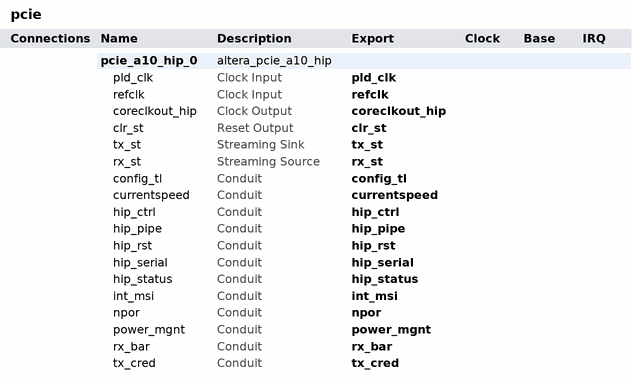
[diagram p0: system contents]
# Platform Designer (Qsys) system pcie, Arria 10 10AX115N2F45I1SG
# Parameters at their usual value, and those the tool derives, are not listed.
package require -exact qsys 18.0
create_system pcie
set_project_property DEVICE_FAMILY {Arria 10}
set_project_property DEVICE 10AX115N2F45I1SG

add_instance pcie_a10_hip_0 altera_pcie_a10_hip 18.0
set_instance_property pcie_a10_hip_0 AUTO_EXPORT true
set_instance_parameter_value pcie_a10_hip_0 adme_enable_hwtcl 0
set_instance_parameter_value pcie_a10_hip_0 advance_error_reporting_hwtcl 0
set_instance_parameter_value pcie_a10_hip_0 apps_type_hwtcl 0
set_instance_parameter_value pcie_a10_hip_0 ari_support_hwtcl 0
set_instance_parameter_value pcie_a10_hip_0 ast_trs_num_desc_hwtcl 16
set_instance_parameter_value pcie_a10_hip_0 ast_trs_rxdata_width_hwtcl 256
set_instance_parameter_value pcie_a10_hip_0 ast_trs_rxdesc_width_hwtcl 256
set_instance_parameter_value pcie_a10_hip_0 ast_trs_rxmty_width_hwtcl 32
set_instance_parameter_value pcie_a10_hip_0 ast_trs_txdata_width_hwtcl 256
set_instance_parameter_value pcie_a10_hip_0 ast_trs_txdesc_width_hwtcl 256
set_instance_parameter_value pcie_a10_hip_0 ast_trs_txmty_width_hwtcl 32
set_instance_parameter_value pcie_a10_hip_0 ast_trs_txstatus_width_hwtcl 256
set_instance_parameter_value pcie_a10_hip_0 avmm_addr_width_hwtcl 64
set_instance_parameter_value pcie_a10_hip_0 bar0_address_width_hwtcl 12
set_instance_parameter_value pcie_a10_hip_0 bar0_type_hwtcl {32-bit non-prefetchable memory}
set_instance_parameter_value pcie_a10_hip_0 bar1_address_width_hwtcl 12
set_instance_parameter_value pcie_a10_hip_0 bar1_type_hwtcl {32-bit non-prefetchable memory}
set_instance_parameter_value pcie_a10_hip_0 bar2_address_width_hwtcl 18
set_instance_parameter_value pcie_a10_hip_0 bar3_address_width_hwtcl 18
set_instance_parameter_value pcie_a10_hip_0 bar3_type_hwtcl {32-bit non-prefetchable memory}
set_instance_parameter_value pcie_a10_hip_0 base_device NIGHTFURY5
set_instance_parameter_value pcie_a10_hip_0 bfm_drive_interface_clk_hwtcl 1
set_instance_parameter_value pcie_a10_hip_0 bfm_drive_interface_control_hwtcl 1
set_instance_parameter_value pcie_a10_hip_0 bfm_drive_interface_npor_hwtcl 1
set_instance_parameter_value pcie_a10_hip_0 bfm_drive_interface_pipe_hwtcl 1
set_instance_parameter_value pcie_a10_hip_0 cg_a2p_addr_map_pass_thru_bits_hwtcl 12
set_instance_parameter_value pcie_a10_hip_0 cg_enable_a2p_interrupt_hwtcl 0
set_instance_parameter_value pcie_a10_hip_0 cg_enable_advanced_interrupt_hwtcl 0
set_instance_parameter_value pcie_a10_hip_0 class_code_hwtcl 16711680
set_instance_parameter_value pcie_a10_hip_0 completion_timeout_hwtcl NONE
set_instance_parameter_value pcie_a10_hip_0 cseb_autonomous_hwtcl 0
set_instance_parameter_value pcie_a10_hip_0 cseb_config_bypass_gui_hwtcl 0
set_instance_parameter_value pcie_a10_hip_0 design_environment_hwtcl QSYS
set_instance_parameter_value pcie_a10_hip_0 devhide_support_hwtcl 0
set_instance_parameter_value pcie_a10_hip_0 device_embedded_ep_support_hwtcl 0
set_instance_parameter_value pcie_a10_hip_0 device_id_hwtcl 4
set_instance_parameter_value pcie_a10_hip_0 dis_adapt 0
set_instance_parameter_value pcie_a10_hip_0 dma_use_scfifo_ext_hwtcl 0
set_instance_parameter_value pcie_a10_hip_0 ecrc_check_capable_hwtcl 0
set_instance_parameter_value pcie_a10_hip_0 ecrc_gen_capable_hwtcl 0
set_instance_parameter_value pcie_a10_hip_0 enable_alternate_link_list_hwtcl 0
set_instance_parameter_value pcie_a10_hip_0 enable_ast_trs_hwtcl 0
set_instance_parameter_value pcie_a10_hip_0 enable_avst_reset_hwtcl 1
set_instance_parameter_value pcie_a10_hip_0 enable_custom_features_hwtcl 0
set_instance_parameter_value pcie_a10_hip_0 enable_devkit_conduit_hwtcl 0
set_instance_parameter_value pcie_a10_hip_0 enable_example_design_qii_hwtcl 1
set_instance_parameter_value pcie_a10_hip_0 enable_example_design_sim_hwtcl 1
set_instance_parameter_value pcie_a10_hip_0 enable_example_design_synth_hwtcl 1
set_instance_parameter_value pcie_a10_hip_0 enable_example_design_tb_hwtcl 1
set_instance_parameter_value pcie_a10_hip_0 enable_g3_bypass_equlz_rp_sim_hwtcl 0
set_instance_parameter_value pcie_a10_hip_0 enable_gen3phase2eq_timechange 0
set_instance_parameter_value pcie_a10_hip_0 enable_hip_status_for_avmm_hwtcl 0
set_instance_parameter_value pcie_a10_hip_0 enable_lmi_hwtcl 0
set_instance_parameter_value pcie_a10_hip_0 enable_nobar_slection_hwtcl 0
set_instance_parameter_value pcie_a10_hip_0 enable_rxm_burst_hwtcl 0
set_instance_parameter_value pcie_a10_hip_0 enable_skp_det 0
set_instance_parameter_value pcie_a10_hip_0 enable_soft_dfe 0
set_instance_parameter_value pcie_a10_hip_0 export_fpll_output_to_top_level_hwtcl 0
set_instance_parameter_value pcie_a10_hip_0 export_phy_input_to_top_level_hwtcl 0
set_instance_parameter_value pcie_a10_hip_0 extended_tag_support_hwtcl 0
set_instance_parameter_value pcie_a10_hip_0 flr_capability_user_hwtcl 0
set_instance_parameter_value pcie_a10_hip_0 force_tag_checking_on_hwtcl 0
set_instance_parameter_value pcie_a10_hip_0 gen3_coeff_1_hwtcl 8
set_instance_parameter_value pcie_a10_hip_0 gen3_coeff_3_ber_meas_hwtcl 12ms
set_instance_parameter_value pcie_a10_hip_0 include_virtio_capabilities_hwtcl 0
set_instance_parameter_value pcie_a10_hip_0 interface_type_hwtcl Avalon-ST
set_instance_parameter_value pcie_a10_hip_0 internal_controller_hwtcl 1
set_instance_parameter_value pcie_a10_hip_0 link2csr_width_hwtcl 16
set_instance_parameter_value pcie_a10_hip_0 maximum_payload_size_hwtcl 2048
set_instance_parameter_value pcie_a10_hip_0 part_trait_device 10AX115R4F40I3SG
set_instance_parameter_value pcie_a10_hip_0 pf0_ats_invalidate_queue_depth_hwtcl 0
set_instance_parameter_value pcie_a10_hip_0 pf0_bar0_prefetchable_hwtcl 1
set_instance_parameter_value pcie_a10_hip_0 pf0_bar0_present_hwtcl 1
set_instance_parameter_value pcie_a10_hip_0 pf0_bar0_size_hwtcl 12
set_instance_parameter_value pcie_a10_hip_0 pf0_bar0_type_hwtcl 1
set_instance_parameter_value pcie_a10_hip_0 pf0_bar1_prefetchable_hwtcl 1
set_instance_parameter_value pcie_a10_hip_0 pf0_bar1_present_hwtcl 0
set_instance_parameter_value pcie_a10_hip_0 pf0_bar1_size_hwtcl 12
set_instance_parameter_value pcie_a10_hip_0 pf0_bar2_prefetchable_hwtcl 1
set_instance_parameter_value pcie_a10_hip_0 pf0_bar2_present_hwtcl 0
set_instance_parameter_value pcie_a10_hip_0 pf0_bar2_size_hwtcl 12
set_instance_parameter_value pcie_a10_hip_0 pf0_bar2_type_hwtcl 1
set_instance_parameter_value pcie_a10_hip_0 pf0_bar3_prefetchable_hwtcl 1
set_instance_parameter_value pcie_a10_hip_0 pf0_bar3_present_hwtcl 0
set_instance_parameter_value pcie_a10_hip_0 pf0_bar3_size_hwtcl 12
set_instance_parameter_value pcie_a10_hip_0 pf0_bar4_prefetchable_hwtcl 1
set_instance_parameter_value pcie_a10_hip_0 pf0_bar4_present_hwtcl 0
set_instance_parameter_value pcie_a10_hip_0 pf0_bar4_size_hwtcl 12
set_instance_parameter_value pcie_a10_hip_0 pf0_bar4_type_hwtcl 1
set_instance_parameter_value pcie_a10_hip_0 pf0_bar5_prefetchable_hwtcl 1
set_instance_parameter_value pcie_a10_hip_0 pf0_bar5_present_hwtcl 0
set_instance_parameter_value pcie_a10_hip_0 pf0_bar5_size_hwtcl 12
set_instance_parameter_value pcie_a10_hip_0 pf0_exprom_bar_present_hwtcl 0
set_instance_parameter_value pcie_a10_hip_0 pf0_exprom_bar_size_hwtcl 12
set_instance_parameter_value pcie_a10_hip_0 pf0_extra_bar_present_hwtcl 0
set_instance_parameter_value pcie_a10_hip_0 pf0_extra_bar_size_hwtcl 12
set_instance_parameter_value pcie_a10_hip_0 pf0_interrupt_pin_hwtcl inta
set_instance_parameter_value pcie_a10_hip_0 pf0_intr_line_hwtcl 0
set_instance_parameter_value pcie_a10_hip_0 pf0_msi_multi_message_capable_hwtcl 4
set_instance_parameter_value pcie_a10_hip_0 pf0_msix_pba_bir_hwtcl 0
set_instance_parameter_value pcie_a10_hip_0 pf0_msix_pba_offset_hwtcl 0
set_instance_parameter_value pcie_a10_hip_0 pf0_msix_table_bir_hwtcl 0
set_instance_parameter_value pcie_a10_hip_0 pf0_msix_table_offset_hwtcl 0
set_instance_parameter_value pcie_a10_hip_0 pf0_msix_table_size_hwtcl 0
set_instance_parameter_value pcie_a10_hip_0 pf0_pci_prog_intfc_byte_hwtcl 0
set_instance_parameter_value pcie_a10_hip_0 pf0_subclass_code_hwtcl 0
set_instance_parameter_value pcie_a10_hip_0 pf0_tph_dev_specific_mode_support_hwtcl 0
set_instance_parameter_value pcie_a10_hip_0 pf0_tph_int_mode_support_hwtcl 0
set_instance_parameter_value pcie_a10_hip_0 pf0_tph_st_table_location_hwtcl 0
set_instance_parameter_value pcie_a10_hip_0 pf0_tph_st_table_size_hwtcl 63
set_instance_parameter_value pcie_a10_hip_0 pf0_vf_bar0_prefetchable_hwtcl 1
set_instance_parameter_value pcie_a10_hip_0 pf0_vf_bar0_present_hwtcl 0
set_instance_parameter_value pcie_a10_hip_0 pf0_vf_bar0_size_hwtcl 12
set_instance_parameter_value pcie_a10_hip_0 pf0_vf_bar0_type_hwtcl 1
set_instance_parameter_value pcie_a10_hip_0 pf0_vf_bar1_prefetchable_hwtcl 1
set_instance_parameter_value pcie_a10_hip_0 pf0_vf_bar1_present_hwtcl 0
set_instance_parameter_value pcie_a10_hip_0 pf0_vf_bar1_size_hwtcl 12
set_instance_parameter_value pcie_a10_hip_0 pf0_vf_bar2_prefetchable_hwtcl 1
set_instance_parameter_value pcie_a10_hip_0 pf0_vf_bar2_present_hwtcl 0
set_instance_parameter_value pcie_a10_hip_0 pf0_vf_bar2_size_hwtcl 12
set_instance_parameter_value pcie_a10_hip_0 pf0_vf_bar2_type_hwtcl 1
set_instance_parameter_value pcie_a10_hip_0 pf0_vf_bar3_prefetchable_hwtcl 1
set_instance_parameter_value pcie_a10_hip_0 pf0_vf_bar3_present_hwtcl 0
set_instance_parameter_value pcie_a10_hip_0 pf0_vf_bar3_size_hwtcl 12
set_instance_parameter_value pcie_a10_hip_0 pf0_vf_bar4_prefetchable_hwtcl 1
set_instance_parameter_value pcie_a10_hip_0 pf0_vf_bar4_present_hwtcl 0
set_instance_parameter_value pcie_a10_hip_0 pf0_vf_bar4_size_hwtcl 12
set_instance_parameter_value pcie_a10_hip_0 pf0_vf_bar4_type_hwtcl 1
set_instance_parameter_value pcie_a10_hip_0 pf0_vf_bar5_prefetchable_hwtcl 1
set_instance_parameter_value pcie_a10_hip_0 pf0_vf_bar5_present_hwtcl 0
set_instance_parameter_value pcie_a10_hip_0 pf0_vf_bar5_size_hwtcl 12
set_instance_parameter_value pcie_a10_hip_0 pf0_vf_count_user_hwtcl 0
set_instance_parameter_value pcie_a10_hip_0 pf0_vf_device_id_hwtcl 0
set_instance_parameter_value pcie_a10_hip_0 pf0_vf_msix_pba_bir_hwtcl 0
set_instance_parameter_value pcie_a10_hip_0 pf0_vf_msix_pba_offset_hwtcl 0
set_instance_parameter_value pcie_a10_hip_0 pf0_vf_msix_tbl_bir_hwtcl 0
set_instance_parameter_value pcie_a10_hip_0 pf0_vf_msix_tbl_offset_hwtcl 0
set_instance_parameter_value pcie_a10_hip_0 pf0_vf_msix_tbl_size_hwtcl 0
set_instance_parameter_value pcie_a10_hip_0 pf0_vf_tph_dev_specific_mode_support_hwtcl 0
set_instance_parameter_value pcie_a10_hip_0 pf0_vf_tph_int_mode_support_hwtcl 0
set_instance_parameter_value pcie_a10_hip_0 pf0_vf_tph_st_table_location_hwtcl 0
set_instance_parameter_value pcie_a10_hip_0 pf0_vf_tph_st_table_size_hwtcl 63
set_instance_parameter_value pcie_a10_hip_0 pf0_virtio_capability_present_hwtcl 0
set_instance_parameter_value pcie_a10_hip_0 pf0_virtio_cmn_config_bar_indicator_hwtcl 0
set_instance_parameter_value pcie_a10_hip_0 pf0_virtio_cmn_config_bar_offset_hwtcl 0
set_instance_parameter_value pcie_a10_hip_0 pf0_virtio_cmn_config_structure_length_hwtcl 0
set_instance_parameter_value pcie_a10_hip_0 pf0_virtio_device_specific_cap_present_hwtcl 0
set_instance_parameter_value pcie_a10_hip_0 pf0_virtio_devspecific_bar_indicator_hwtcl 0
set_instance_parameter_value pcie_a10_hip_0 pf0_virtio_devspecific_bar_offset_hwtcl 0
set_instance_parameter_value pcie_a10_hip_0 pf0_virtio_devspecific_structure_length_hwtcl 0
set_instance_parameter_value pcie_a10_hip_0 pf0_virtio_isrstatus_bar_indicator_hwtcl 0
set_instance_parameter_value pcie_a10_hip_0 pf0_virtio_isrstatus_bar_offset_hwtcl 0
set_instance_parameter_value pcie_a10_hip_0 pf0_virtio_isrstatus_structure_length_hwtcl 0
set_instance_parameter_value pcie_a10_hip_0 pf0_virtio_notification_bar_indicator_hwtcl 0
set_instance_parameter_value pcie_a10_hip_0 pf0_virtio_notification_bar_offset_hwtcl 0
set_instance_parameter_value pcie_a10_hip_0 pf0_virtio_notification_structure_length_hwtcl 0
set_instance_parameter_value pcie_a10_hip_0 pf0_virtio_notify_off_multiplier_hwtcl 0
set_instance_parameter_value pcie_a10_hip_0 pf0_virtio_pciconfig_access_bar_indicator_hwtcl 0
set_instance_parameter_value pcie_a10_hip_0 pf0_virtio_pciconfig_access_bar_offset_hwtcl 0
set_instance_parameter_value pcie_a10_hip_0 pf0_virtio_pciconfig_access_structure_length_hwtcl 0
set_instance_parameter_value pcie_a10_hip_0 pf1_ats_invalidate_queue_depth_hwtcl 0
set_instance_parameter_value pcie_a10_hip_0 pf1_bar0_prefetchable_hwtcl 1
set_instance_parameter_value pcie_a10_hip_0 pf1_bar0_present_hwtcl 0
set_instance_parameter_value pcie_a10_hip_0 pf1_bar0_size_hwtcl 12
set_instance_parameter_value pcie_a10_hip_0 pf1_bar0_type_hwtcl 1
set_instance_parameter_value pcie_a10_hip_0 pf1_bar1_prefetchable_hwtcl 1
set_instance_parameter_value pcie_a10_hip_0 pf1_bar1_present_hwtcl 0
set_instance_parameter_value pcie_a10_hip_0 pf1_bar1_size_hwtcl 12
set_instance_parameter_value pcie_a10_hip_0 pf1_bar2_prefetchable_hwtcl 1
set_instance_parameter_value pcie_a10_hip_0 pf1_bar2_present_hwtcl 0
set_instance_parameter_value pcie_a10_hip_0 pf1_bar2_size_hwtcl 12
set_instance_parameter_value pcie_a10_hip_0 pf1_bar2_type_hwtcl 1
set_instance_parameter_value pcie_a10_hip_0 pf1_bar3_prefetchable_hwtcl 1
set_instance_parameter_value pcie_a10_hip_0 pf1_bar3_present_hwtcl 0
set_instance_parameter_value pcie_a10_hip_0 pf1_bar3_size_hwtcl 12
set_instance_parameter_value pcie_a10_hip_0 pf1_bar4_prefetchable_hwtcl 1
set_instance_parameter_value pcie_a10_hip_0 pf1_bar4_present_hwtcl 0
set_instance_parameter_value pcie_a10_hip_0 pf1_bar4_size_hwtcl 12
set_instance_parameter_value pcie_a10_hip_0 pf1_bar4_type_hwtcl 1
set_instance_parameter_value pcie_a10_hip_0 pf1_bar5_prefetchable_hwtcl 1
set_instance_parameter_value pcie_a10_hip_0 pf1_bar5_present_hwtcl 0
set_instance_parameter_value pcie_a10_hip_0 pf1_bar5_size_hwtcl 12
set_instance_parameter_value pcie_a10_hip_0 pf1_class_code_hwtcl 0
set_instance_parameter_value pcie_a10_hip_0 pf1_device_id_hwtcl 0
set_instance_parameter_value pcie_a10_hip_0 pf1_exprom_bar_present_hwtcl 0
set_instance_parameter_value pcie_a10_hip_0 pf1_exprom_bar_size_hwtcl 12
set_instance_parameter_value pcie_a10_hip_0 pf1_interrupt_pin_hwtcl inta
set_instance_parameter_value pcie_a10_hip_0 pf1_intr_line_hwtcl 0
set_instance_parameter_value pcie_a10_hip_0 pf1_msi_multi_message_capable_hwtcl 4
set_instance_parameter_value pcie_a10_hip_0 pf1_msix_pba_bir_hwtcl 0
set_instance_parameter_value pcie_a10_hip_0 pf1_msix_pba_offset_hwtcl 0
set_instance_parameter_value pcie_a10_hip_0 pf1_msix_table_bir_hwtcl 0
set_instance_parameter_value pcie_a10_hip_0 pf1_msix_table_offset_hwtcl 0
set_instance_parameter_value pcie_a10_hip_0 pf1_msix_table_size_hwtcl 0
set_instance_parameter_value pcie_a10_hip_0 pf1_pci_prog_intfc_byte_hwtcl 0
set_instance_parameter_value pcie_a10_hip_0 pf1_revision_id_hwtcl 0
set_instance_parameter_value pcie_a10_hip_0 pf1_subclass_code_hwtcl 0
set_instance_parameter_value pcie_a10_hip_0 pf1_subsystem_device_id_hwtcl 0
set_instance_parameter_value pcie_a10_hip_0 pf1_subsystem_vendor_id_hwtcl 0
set_instance_parameter_value pcie_a10_hip_0 pf1_tph_dev_specific_mode_support_hwtcl 0
set_instance_parameter_value pcie_a10_hip_0 pf1_tph_int_mode_support_hwtcl 0
set_instance_parameter_value pcie_a10_hip_0 pf1_tph_st_table_location_hwtcl 0
set_instance_parameter_value pcie_a10_hip_0 pf1_tph_st_table_size_hwtcl 63
set_instance_parameter_value pcie_a10_hip_0 pf1_vendor_id_hwtcl 0
set_instance_parameter_value pcie_a10_hip_0 pf1_vf_bar0_prefetchable_hwtcl 1
set_instance_parameter_value pcie_a10_hip_0 pf1_vf_bar0_present_hwtcl 0
set_instance_parameter_value pcie_a10_hip_0 pf1_vf_bar0_size_hwtcl 12
set_instance_parameter_value pcie_a10_hip_0 pf1_vf_bar0_type_hwtcl 1
set_instance_parameter_value pcie_a10_hip_0 pf1_vf_bar1_prefetchable_hwtcl 1
set_instance_parameter_value pcie_a10_hip_0 pf1_vf_bar1_present_hwtcl 0
set_instance_parameter_value pcie_a10_hip_0 pf1_vf_bar1_size_hwtcl 12
set_instance_parameter_value pcie_a10_hip_0 pf1_vf_bar2_prefetchable_hwtcl 1
set_instance_parameter_value pcie_a10_hip_0 pf1_vf_bar2_present_hwtcl 0
set_instance_parameter_value pcie_a10_hip_0 pf1_vf_bar2_size_hwtcl 12
set_instance_parameter_value pcie_a10_hip_0 pf1_vf_bar2_type_hwtcl 1
set_instance_parameter_value pcie_a10_hip_0 pf1_vf_bar3_prefetchable_hwtcl 1
set_instance_parameter_value pcie_a10_hip_0 pf1_vf_bar3_present_hwtcl 0
set_instance_parameter_value pcie_a10_hip_0 pf1_vf_bar3_size_hwtcl 12
set_instance_parameter_value pcie_a10_hip_0 pf1_vf_bar4_prefetchable_hwtcl 1
set_instance_parameter_value pcie_a10_hip_0 pf1_vf_bar4_present_hwtcl 0
set_instance_parameter_value pcie_a10_hip_0 pf1_vf_bar4_size_hwtcl 12
set_instance_parameter_value pcie_a10_hip_0 pf1_vf_bar4_type_hwtcl 1
set_instance_parameter_value pcie_a10_hip_0 pf1_vf_bar5_prefetchable_hwtcl 1
set_instance_parameter_value pcie_a10_hip_0 pf1_vf_bar5_present_hwtcl 0
set_instance_parameter_value pcie_a10_hip_0 pf1_vf_bar5_size_hwtcl 12
set_instance_parameter_value pcie_a10_hip_0 pf1_vf_count_user_hwtcl 0
set_instance_parameter_value pcie_a10_hip_0 pf1_vf_device_id_hwtcl 0
set_instance_parameter_value pcie_a10_hip_0 pf1_vf_msix_pba_bir_hwtcl 0
set_instance_parameter_value pcie_a10_hip_0 pf1_vf_msix_pba_offset_hwtcl 0
set_instance_parameter_value pcie_a10_hip_0 pf1_vf_msix_tbl_bir_hwtcl 0
set_instance_parameter_value pcie_a10_hip_0 pf1_vf_msix_tbl_offset_hwtcl 0
set_instance_parameter_value pcie_a10_hip_0 pf1_vf_msix_tbl_size_hwtcl 0
set_instance_parameter_value pcie_a10_hip_0 pf1_vf_tph_dev_specific_mode_support_hwtcl 0
set_instance_parameter_value pcie_a10_hip_0 pf1_vf_tph_int_mode_support_hwtcl 0
set_instance_parameter_value pcie_a10_hip_0 pf1_vf_tph_st_table_location_hwtcl 0
set_instance_parameter_value pcie_a10_hip_0 pf1_vf_tph_st_table_size_hwtcl 63
set_instance_parameter_value pcie_a10_hip_0 pf1_virtio_capability_present_hwtcl 0
set_instance_parameter_value pcie_a10_hip_0 pf1_virtio_cmn_config_bar_indicator_hwtcl 0
set_instance_parameter_value pcie_a10_hip_0 pf1_virtio_cmn_config_bar_offset_hwtcl 0
set_instance_parameter_value pcie_a10_hip_0 pf1_virtio_cmn_config_structure_length_hwtcl 0
set_instance_parameter_value pcie_a10_hip_0 pf1_virtio_device_specific_cap_present_hwtcl 0
set_instance_parameter_value pcie_a10_hip_0 pf1_virtio_devspecific_bar_indicator_hwtcl 0
set_instance_parameter_value pcie_a10_hip_0 pf1_virtio_devspecific_bar_offset_hwtcl 0
set_instance_parameter_value pcie_a10_hip_0 pf1_virtio_devspecific_structure_length_hwtcl 0
set_instance_parameter_value pcie_a10_hip_0 pf1_virtio_isrstatus_bar_indicator_hwtcl 0
set_instance_parameter_value pcie_a10_hip_0 pf1_virtio_isrstatus_bar_offset_hwtcl 0
set_instance_parameter_value pcie_a10_hip_0 pf1_virtio_isrstatus_structure_length_hwtcl 0
set_instance_parameter_value pcie_a10_hip_0 pf1_virtio_notification_bar_indicator_hwtcl 0
set_instance_parameter_value pcie_a10_hip_0 pf1_virtio_notification_bar_offset_hwtcl 0
set_instance_parameter_value pcie_a10_hip_0 pf1_virtio_notification_structure_length_hwtcl 0
set_instance_parameter_value pcie_a10_hip_0 pf1_virtio_notify_off_multiplier_hwtcl 0
set_instance_parameter_value pcie_a10_hip_0 pf1_virtio_pciconfig_access_bar_indicator_hwtcl 0
set_instance_parameter_value pcie_a10_hip_0 pf1_virtio_pciconfig_access_bar_offset_hwtcl 0
set_instance_parameter_value pcie_a10_hip_0 pf1_virtio_pciconfig_access_structure_length_hwtcl 0
set_instance_parameter_value pcie_a10_hip_0 pf2_ats_invalidate_queue_depth_hwtcl 0
set_instance_parameter_value pcie_a10_hip_0 pf2_bar0_prefetchable_hwtcl 1
set_instance_parameter_value pcie_a10_hip_0 pf2_bar0_present_hwtcl 0
set_instance_parameter_value pcie_a10_hip_0 pf2_bar0_size_hwtcl 12
set_instance_parameter_value pcie_a10_hip_0 pf2_bar0_type_hwtcl 1
set_instance_parameter_value pcie_a10_hip_0 pf2_bar1_prefetchable_hwtcl 1
set_instance_parameter_value pcie_a10_hip_0 pf2_bar1_present_hwtcl 0
set_instance_parameter_value pcie_a10_hip_0 pf2_bar1_size_hwtcl 12
set_instance_parameter_value pcie_a10_hip_0 pf2_bar2_prefetchable_hwtcl 1
set_instance_parameter_value pcie_a10_hip_0 pf2_bar2_present_hwtcl 0
set_instance_parameter_value pcie_a10_hip_0 pf2_bar2_size_hwtcl 12
set_instance_parameter_value pcie_a10_hip_0 pf2_bar2_type_hwtcl 1
set_instance_parameter_value pcie_a10_hip_0 pf2_bar3_prefetchable_hwtcl 1
set_instance_parameter_value pcie_a10_hip_0 pf2_bar3_present_hwtcl 0
set_instance_parameter_value pcie_a10_hip_0 pf2_bar3_size_hwtcl 12
set_instance_parameter_value pcie_a10_hip_0 pf2_bar4_prefetchable_hwtcl 1
set_instance_parameter_value pcie_a10_hip_0 pf2_bar4_present_hwtcl 0
set_instance_parameter_value pcie_a10_hip_0 pf2_bar4_size_hwtcl 12
set_instance_parameter_value pcie_a10_hip_0 pf2_bar4_type_hwtcl 1
set_instance_parameter_value pcie_a10_hip_0 pf2_bar5_prefetchable_hwtcl 1
set_instance_parameter_value pcie_a10_hip_0 pf2_bar5_present_hwtcl 0
set_instance_parameter_value pcie_a10_hip_0 pf2_bar5_size_hwtcl 12
set_instance_parameter_value pcie_a10_hip_0 pf2_class_code_hwtcl 0
set_instance_parameter_value pcie_a10_hip_0 pf2_device_id_hwtcl 0
set_instance_parameter_value pcie_a10_hip_0 pf2_exprom_bar_present_hwtcl 0
set_instance_parameter_value pcie_a10_hip_0 pf2_exprom_bar_size_hwtcl 12
set_instance_parameter_value pcie_a10_hip_0 pf2_interrupt_pin_hwtcl inta
set_instance_parameter_value pcie_a10_hip_0 pf2_intr_line_hwtcl 0
set_instance_parameter_value pcie_a10_hip_0 pf2_msi_multi_message_capable_hwtcl 4
set_instance_parameter_value pcie_a10_hip_0 pf2_msix_pba_bir_hwtcl 0
set_instance_parameter_value pcie_a10_hip_0 pf2_msix_pba_offset_hwtcl 0
set_instance_parameter_value pcie_a10_hip_0 pf2_msix_table_bir_hwtcl 0
set_instance_parameter_value pcie_a10_hip_0 pf2_msix_table_offset_hwtcl 0
set_instance_parameter_value pcie_a10_hip_0 pf2_msix_table_size_hwtcl 0
set_instance_parameter_value pcie_a10_hip_0 pf2_pci_prog_intfc_byte_hwtcl 0
set_instance_parameter_value pcie_a10_hip_0 pf2_revision_id_hwtcl 0
set_instance_parameter_value pcie_a10_hip_0 pf2_subclass_code_hwtcl 0
set_instance_parameter_value pcie_a10_hip_0 pf2_subsystem_device_id_hwtcl 0
set_instance_parameter_value pcie_a10_hip_0 pf2_subsystem_vendor_id_hwtcl 0
set_instance_parameter_value pcie_a10_hip_0 pf2_tph_dev_specific_mode_support_hwtcl 0
set_instance_parameter_value pcie_a10_hip_0 pf2_tph_int_mode_support_hwtcl 0
set_instance_parameter_value pcie_a10_hip_0 pf2_tph_st_table_location_hwtcl 0
set_instance_parameter_value pcie_a10_hip_0 pf2_tph_st_table_size_hwtcl 63
set_instance_parameter_value pcie_a10_hip_0 pf2_vendor_id_hwtcl 0
set_instance_parameter_value pcie_a10_hip_0 pf2_vf_bar0_prefetchable_hwtcl 1
set_instance_parameter_value pcie_a10_hip_0 pf2_vf_bar0_present_hwtcl 0
set_instance_parameter_value pcie_a10_hip_0 pf2_vf_bar0_size_hwtcl 12
set_instance_parameter_value pcie_a10_hip_0 pf2_vf_bar0_type_hwtcl 1
set_instance_parameter_value pcie_a10_hip_0 pf2_vf_bar1_prefetchable_hwtcl 1
set_instance_parameter_value pcie_a10_hip_0 pf2_vf_bar1_present_hwtcl 0
set_instance_parameter_value pcie_a10_hip_0 pf2_vf_bar1_size_hwtcl 12
set_instance_parameter_value pcie_a10_hip_0 pf2_vf_bar2_prefetchable_hwtcl 1
set_instance_parameter_value pcie_a10_hip_0 pf2_vf_bar2_present_hwtcl 0
set_instance_parameter_value pcie_a10_hip_0 pf2_vf_bar2_size_hwtcl 12
set_instance_parameter_value pcie_a10_hip_0 pf2_vf_bar2_type_hwtcl 1
set_instance_parameter_value pcie_a10_hip_0 pf2_vf_bar3_prefetchable_hwtcl 1
set_instance_parameter_value pcie_a10_hip_0 pf2_vf_bar3_present_hwtcl 0
set_instance_parameter_value pcie_a10_hip_0 pf2_vf_bar3_size_hwtcl 12
set_instance_parameter_value pcie_a10_hip_0 pf2_vf_bar4_prefetchable_hwtcl 1
set_instance_parameter_value pcie_a10_hip_0 pf2_vf_bar4_present_hwtcl 0
set_instance_parameter_value pcie_a10_hip_0 pf2_vf_bar4_size_hwtcl 12
set_instance_parameter_value pcie_a10_hip_0 pf2_vf_bar4_type_hwtcl 1
set_instance_parameter_value pcie_a10_hip_0 pf2_vf_bar5_prefetchable_hwtcl 1
set_instance_parameter_value pcie_a10_hip_0 pf2_vf_bar5_present_hwtcl 0
set_instance_parameter_value pcie_a10_hip_0 pf2_vf_bar5_size_hwtcl 12
set_instance_parameter_value pcie_a10_hip_0 pf2_vf_count_user_hwtcl 0
set_instance_parameter_value pcie_a10_hip_0 pf2_vf_device_id_hwtcl 0
set_instance_parameter_value pcie_a10_hip_0 pf2_vf_msix_pba_bir_hwtcl 0
set_instance_parameter_value pcie_a10_hip_0 pf2_vf_msix_pba_offset_hwtcl 0
set_instance_parameter_value pcie_a10_hip_0 pf2_vf_msix_tbl_bir_hwtcl 0
set_instance_parameter_value pcie_a10_hip_0 pf2_vf_msix_tbl_offset_hwtcl 0
set_instance_parameter_value pcie_a10_hip_0 pf2_vf_msix_tbl_size_hwtcl 0
set_instance_parameter_value pcie_a10_hip_0 pf2_vf_tph_dev_specific_mode_support_hwtcl 0
set_instance_parameter_value pcie_a10_hip_0 pf2_vf_tph_int_mode_support_hwtcl 0
set_instance_parameter_value pcie_a10_hip_0 pf2_vf_tph_st_table_location_hwtcl 0
set_instance_parameter_value pcie_a10_hip_0 pf2_vf_tph_st_table_size_hwtcl 63
set_instance_parameter_value pcie_a10_hip_0 pf2_virtio_capability_present_hwtcl 0
set_instance_parameter_value pcie_a10_hip_0 pf2_virtio_cmn_config_bar_indicator_hwtcl 0
set_instance_parameter_value pcie_a10_hip_0 pf2_virtio_cmn_config_bar_offset_hwtcl 0
set_instance_parameter_value pcie_a10_hip_0 pf2_virtio_cmn_config_structure_length_hwtcl 0
set_instance_parameter_value pcie_a10_hip_0 pf2_virtio_device_specific_cap_present_hwtcl 0
set_instance_parameter_value pcie_a10_hip_0 pf2_virtio_devspecific_bar_indicator_hwtcl 0
set_instance_parameter_value pcie_a10_hip_0 pf2_virtio_devspecific_bar_offset_hwtcl 0
set_instance_parameter_value pcie_a10_hip_0 pf2_virtio_devspecific_structure_length_hwtcl 0
set_instance_parameter_value pcie_a10_hip_0 pf2_virtio_isrstatus_bar_indicator_hwtcl 0
set_instance_parameter_value pcie_a10_hip_0 pf2_virtio_isrstatus_bar_offset_hwtcl 0
set_instance_parameter_value pcie_a10_hip_0 pf2_virtio_isrstatus_structure_length_hwtcl 0
set_instance_parameter_value pcie_a10_hip_0 pf2_virtio_notification_bar_indicator_hwtcl 0
set_instance_parameter_value pcie_a10_hip_0 pf2_virtio_notification_bar_offset_hwtcl 0
set_instance_parameter_value pcie_a10_hip_0 pf2_virtio_notification_structure_length_hwtcl 0
set_instance_parameter_value pcie_a10_hip_0 pf2_virtio_notify_off_multiplier_hwtcl 0
set_instance_parameter_value pcie_a10_hip_0 pf2_virtio_pciconfig_access_bar_indicator_hwtcl 0
set_instance_parameter_value pcie_a10_hip_0 pf2_virtio_pciconfig_access_bar_offset_hwtcl 0
set_instance_parameter_value pcie_a10_hip_0 pf2_virtio_pciconfig_access_structure_length_hwtcl 0
set_instance_parameter_value pcie_a10_hip_0 pf3_ats_invalidate_queue_depth_hwtcl 0
set_instance_parameter_value pcie_a10_hip_0 pf3_bar0_prefetchable_hwtcl 1
set_instance_parameter_value pcie_a10_hip_0 pf3_bar0_present_hwtcl 0
set_instance_parameter_value pcie_a10_hip_0 pf3_bar0_size_hwtcl 12
set_instance_parameter_value pcie_a10_hip_0 pf3_bar0_type_hwtcl 1
set_instance_parameter_value pcie_a10_hip_0 pf3_bar1_prefetchable_hwtcl 1
set_instance_parameter_value pcie_a10_hip_0 pf3_bar1_present_hwtcl 0
set_instance_parameter_value pcie_a10_hip_0 pf3_bar1_size_hwtcl 12
set_instance_parameter_value pcie_a10_hip_0 pf3_bar2_prefetchable_hwtcl 1
set_instance_parameter_value pcie_a10_hip_0 pf3_bar2_present_hwtcl 0
set_instance_parameter_value pcie_a10_hip_0 pf3_bar2_size_hwtcl 12
set_instance_parameter_value pcie_a10_hip_0 pf3_bar2_type_hwtcl 1
set_instance_parameter_value pcie_a10_hip_0 pf3_bar3_prefetchable_hwtcl 1
set_instance_parameter_value pcie_a10_hip_0 pf3_bar3_present_hwtcl 0
set_instance_parameter_value pcie_a10_hip_0 pf3_bar3_size_hwtcl 12
set_instance_parameter_value pcie_a10_hip_0 pf3_bar4_prefetchable_hwtcl 1
set_instance_parameter_value pcie_a10_hip_0 pf3_bar4_present_hwtcl 0
set_instance_parameter_value pcie_a10_hip_0 pf3_bar4_size_hwtcl 12
set_instance_parameter_value pcie_a10_hip_0 pf3_bar4_type_hwtcl 1
set_instance_parameter_value pcie_a10_hip_0 pf3_bar5_prefetchable_hwtcl 1
set_instance_parameter_value pcie_a10_hip_0 pf3_bar5_present_hwtcl 0
set_instance_parameter_value pcie_a10_hip_0 pf3_bar5_size_hwtcl 12
set_instance_parameter_value pcie_a10_hip_0 pf3_class_code_hwtcl 0
set_instance_parameter_value pcie_a10_hip_0 pf3_device_id_hwtcl 0
set_instance_parameter_value pcie_a10_hip_0 pf3_exprom_bar_present_hwtcl 0
set_instance_parameter_value pcie_a10_hip_0 pf3_exprom_bar_size_hwtcl 12
set_instance_parameter_value pcie_a10_hip_0 pf3_interrupt_pin_hwtcl inta
set_instance_parameter_value pcie_a10_hip_0 pf3_intr_line_hwtcl 0
set_instance_parameter_value pcie_a10_hip_0 pf3_msi_multi_message_capable_hwtcl 4
set_instance_parameter_value pcie_a10_hip_0 pf3_msix_pba_bir_hwtcl 0
set_instance_parameter_value pcie_a10_hip_0 pf3_msix_pba_offset_hwtcl 0
set_instance_parameter_value pcie_a10_hip_0 pf3_msix_table_bir_hwtcl 0
set_instance_parameter_value pcie_a10_hip_0 pf3_msix_table_offset_hwtcl 0
set_instance_parameter_value pcie_a10_hip_0 pf3_msix_table_size_hwtcl 0
set_instance_parameter_value pcie_a10_hip_0 pf3_pci_prog_intfc_byte_hwtcl 0
set_instance_parameter_value pcie_a10_hip_0 pf3_revision_id_hwtcl 0
set_instance_parameter_value pcie_a10_hip_0 pf3_subclass_code_hwtcl 0
set_instance_parameter_value pcie_a10_hip_0 pf3_subsystem_device_id_hwtcl 0
set_instance_parameter_value pcie_a10_hip_0 pf3_subsystem_vendor_id_hwtcl 0
set_instance_parameter_value pcie_a10_hip_0 pf3_tph_dev_specific_mode_support_hwtcl 0
set_instance_parameter_value pcie_a10_hip_0 pf3_tph_int_mode_support_hwtcl 0
set_instance_parameter_value pcie_a10_hip_0 pf3_tph_st_table_location_hwtcl 0
set_instance_parameter_value pcie_a10_hip_0 pf3_tph_st_table_size_hwtcl 63
set_instance_parameter_value pcie_a10_hip_0 pf3_vendor_id_hwtcl 0
set_instance_parameter_value pcie_a10_hip_0 pf3_vf_bar0_prefetchable_hwtcl 1
set_instance_parameter_value pcie_a10_hip_0 pf3_vf_bar0_present_hwtcl 0
set_instance_parameter_value pcie_a10_hip_0 pf3_vf_bar0_size_hwtcl 12
set_instance_parameter_value pcie_a10_hip_0 pf3_vf_bar0_type_hwtcl 1
set_instance_parameter_value pcie_a10_hip_0 pf3_vf_bar1_prefetchable_hwtcl 1
set_instance_parameter_value pcie_a10_hip_0 pf3_vf_bar1_present_hwtcl 0
set_instance_parameter_value pcie_a10_hip_0 pf3_vf_bar1_size_hwtcl 12
set_instance_parameter_value pcie_a10_hip_0 pf3_vf_bar2_prefetchable_hwtcl 1
set_instance_parameter_value pcie_a10_hip_0 pf3_vf_bar2_present_hwtcl 0
set_instance_parameter_value pcie_a10_hip_0 pf3_vf_bar2_size_hwtcl 12
set_instance_parameter_value pcie_a10_hip_0 pf3_vf_bar2_type_hwtcl 1
set_instance_parameter_value pcie_a10_hip_0 pf3_vf_bar3_prefetchable_hwtcl 1
set_instance_parameter_value pcie_a10_hip_0 pf3_vf_bar3_present_hwtcl 0
set_instance_parameter_value pcie_a10_hip_0 pf3_vf_bar3_size_hwtcl 12
set_instance_parameter_value pcie_a10_hip_0 pf3_vf_bar4_prefetchable_hwtcl 1
set_instance_parameter_value pcie_a10_hip_0 pf3_vf_bar4_present_hwtcl 0
set_instance_parameter_value pcie_a10_hip_0 pf3_vf_bar4_size_hwtcl 12
set_instance_parameter_value pcie_a10_hip_0 pf3_vf_bar4_type_hwtcl 1
set_instance_parameter_value pcie_a10_hip_0 pf3_vf_bar5_prefetchable_hwtcl 1
set_instance_parameter_value pcie_a10_hip_0 pf3_vf_bar5_present_hwtcl 0
set_instance_parameter_value pcie_a10_hip_0 pf3_vf_bar5_size_hwtcl 12
set_instance_parameter_value pcie_a10_hip_0 pf3_vf_count_user_hwtcl 0
set_instance_parameter_value pcie_a10_hip_0 pf3_vf_device_id_hwtcl 0
set_instance_parameter_value pcie_a10_hip_0 pf3_vf_msix_pba_bir_hwtcl 0
set_instance_parameter_value pcie_a10_hip_0 pf3_vf_msix_pba_offset_hwtcl 0
set_instance_parameter_value pcie_a10_hip_0 pf3_vf_msix_tbl_bir_hwtcl 0
set_instance_parameter_value pcie_a10_hip_0 pf3_vf_msix_tbl_offset_hwtcl 0
set_instance_parameter_value pcie_a10_hip_0 pf3_vf_msix_tbl_size_hwtcl 0
set_instance_parameter_value pcie_a10_hip_0 pf3_vf_tph_dev_specific_mode_support_hwtcl 0
set_instance_parameter_value pcie_a10_hip_0 pf3_vf_tph_int_mode_support_hwtcl 0
set_instance_parameter_value pcie_a10_hip_0 pf3_vf_tph_st_table_location_hwtcl 0
set_instance_parameter_value pcie_a10_hip_0 pf3_vf_tph_st_table_size_hwtcl 63
set_instance_parameter_value pcie_a10_hip_0 pf3_virtio_capability_present_hwtcl 0
set_instance_parameter_value pcie_a10_hip_0 pf3_virtio_cmn_config_bar_indicator_hwtcl 0
set_instance_parameter_value pcie_a10_hip_0 pf3_virtio_cmn_config_bar_offset_hwtcl 0
set_instance_parameter_value pcie_a10_hip_0 pf3_virtio_cmn_config_structure_length_hwtcl 0
set_instance_parameter_value pcie_a10_hip_0 pf3_virtio_device_specific_cap_present_hwtcl 0
set_instance_parameter_value pcie_a10_hip_0 pf3_virtio_devspecific_bar_indicator_hwtcl 0
set_instance_parameter_value pcie_a10_hip_0 pf3_virtio_devspecific_bar_offset_hwtcl 0
set_instance_parameter_value pcie_a10_hip_0 pf3_virtio_devspecific_structure_length_hwtcl 0
set_instance_parameter_value pcie_a10_hip_0 pf3_virtio_isrstatus_bar_indicator_hwtcl 0
set_instance_parameter_value pcie_a10_hip_0 pf3_virtio_isrstatus_bar_offset_hwtcl 0
set_instance_parameter_value pcie_a10_hip_0 pf3_virtio_isrstatus_structure_length_hwtcl 0
set_instance_parameter_value pcie_a10_hip_0 pf3_virtio_notification_bar_indicator_hwtcl 0
set_instance_parameter_value pcie_a10_hip_0 pf3_virtio_notification_bar_offset_hwtcl 0
set_instance_parameter_value pcie_a10_hip_0 pf3_virtio_notification_structure_length_hwtcl 0
set_instance_parameter_value pcie_a10_hip_0 pf3_virtio_notify_off_multiplier_hwtcl 0
set_instance_parameter_value pcie_a10_hip_0 pf3_virtio_pciconfig_access_bar_indicator_hwtcl 0
set_instance_parameter_value pcie_a10_hip_0 pf3_virtio_pciconfig_access_bar_offset_hwtcl 0
set_instance_parameter_value pcie_a10_hip_0 pf3_virtio_pciconfig_access_structure_length_hwtcl 0
set_instance_parameter_value pcie_a10_hip_0 pf4_bar0_prefetchable_hwtcl 1
set_instance_parameter_value pcie_a10_hip_0 pf4_bar0_present_hwtcl 0
set_instance_parameter_value pcie_a10_hip_0 pf4_bar0_size_hwtcl 12
set_instance_parameter_value pcie_a10_hip_0 pf4_bar0_type_hwtcl 1
set_instance_parameter_value pcie_a10_hip_0 pf4_bar1_prefetchable_hwtcl 1
set_instance_parameter_value pcie_a10_hip_0 pf4_bar1_present_hwtcl 0
set_instance_parameter_value pcie_a10_hip_0 pf4_bar1_size_hwtcl 12
set_instance_parameter_value pcie_a10_hip_0 pf4_bar2_prefetchable_hwtcl 1
set_instance_parameter_value pcie_a10_hip_0 pf4_bar2_present_hwtcl 0
set_instance_parameter_value pcie_a10_hip_0 pf4_bar2_size_hwtcl 12
set_instance_parameter_value pcie_a10_hip_0 pf4_bar2_type_hwtcl 1
set_instance_parameter_value pcie_a10_hip_0 pf4_bar3_prefetchable_hwtcl 1
set_instance_parameter_value pcie_a10_hip_0 pf4_bar3_present_hwtcl 0
set_instance_parameter_value pcie_a10_hip_0 pf4_bar3_size_hwtcl 12
set_instance_parameter_value pcie_a10_hip_0 pf4_bar4_prefetchable_hwtcl 1
set_instance_parameter_value pcie_a10_hip_0 pf4_bar4_present_hwtcl 0
set_instance_parameter_value pcie_a10_hip_0 pf4_bar4_size_hwtcl 12
set_instance_parameter_value pcie_a10_hip_0 pf4_bar4_type_hwtcl 1
set_instance_parameter_value pcie_a10_hip_0 pf4_bar5_prefetchable_hwtcl 1
set_instance_parameter_value pcie_a10_hip_0 pf4_bar5_present_hwtcl 0
set_instance_parameter_value pcie_a10_hip_0 pf4_bar5_size_hwtcl 12
set_instance_parameter_value pcie_a10_hip_0 pf4_class_code_hwtcl 0
set_instance_parameter_value pcie_a10_hip_0 pf4_device_id_hwtcl 0
set_instance_parameter_value pcie_a10_hip_0 pf4_exprom_bar_present_hwtcl 0
set_instance_parameter_value pcie_a10_hip_0 pf4_exprom_bar_size_hwtcl 12
set_instance_parameter_value pcie_a10_hip_0 pf4_interrupt_pin_hwtcl inta
set_instance_parameter_value pcie_a10_hip_0 pf4_intr_line_hwtcl 0
set_instance_parameter_value pcie_a10_hip_0 pf4_msi_multi_message_capable_hwtcl 4
set_instance_parameter_value pcie_a10_hip_0 pf4_msix_pba_bir_hwtcl 0
set_instance_parameter_value pcie_a10_hip_0 pf4_msix_pba_offset_hwtcl 0
set_instance_parameter_value pcie_a10_hip_0 pf4_msix_table_bir_hwtcl 0
set_instance_parameter_value pcie_a10_hip_0 pf4_msix_table_offset_hwtcl 0
set_instance_parameter_value pcie_a10_hip_0 pf4_msix_table_size_hwtcl 0
set_instance_parameter_value pcie_a10_hip_0 pf4_pci_prog_intfc_byte_hwtcl 0
set_instance_parameter_value pcie_a10_hip_0 pf4_revision_id_hwtcl 0
set_instance_parameter_value pcie_a10_hip_0 pf4_subclass_code_hwtcl 0
set_instance_parameter_value pcie_a10_hip_0 pf4_subsystem_device_id_hwtcl 0
set_instance_parameter_value pcie_a10_hip_0 pf4_subsystem_vendor_id_hwtcl 0
set_instance_parameter_value pcie_a10_hip_0 pf4_vendor_id_hwtcl 0
set_instance_parameter_value pcie_a10_hip_0 pf4_vf_device_id_hwtcl 0
set_instance_parameter_value pcie_a10_hip_0 pf4_virtio_capability_present_hwtcl 0
set_instance_parameter_value pcie_a10_hip_0 pf4_virtio_cmn_config_bar_indicator_hwtcl 0
set_instance_parameter_value pcie_a10_hip_0 pf4_virtio_cmn_config_bar_offset_hwtcl 0
set_instance_parameter_value pcie_a10_hip_0 pf4_virtio_cmn_config_structure_length_hwtcl 0
set_instance_parameter_value pcie_a10_hip_0 pf4_virtio_device_specific_cap_present_hwtcl 0
set_instance_parameter_value pcie_a10_hip_0 pf4_virtio_devspecific_bar_indicator_hwtcl 0
set_instance_parameter_value pcie_a10_hip_0 pf4_virtio_devspecific_bar_offset_hwtcl 0
set_instance_parameter_value pcie_a10_hip_0 pf4_virtio_devspecific_structure_length_hwtcl 0
set_instance_parameter_value pcie_a10_hip_0 pf4_virtio_isrstatus_bar_indicator_hwtcl 0
set_instance_parameter_value pcie_a10_hip_0 pf4_virtio_isrstatus_bar_offset_hwtcl 0
set_instance_parameter_value pcie_a10_hip_0 pf4_virtio_isrstatus_structure_length_hwtcl 0
set_instance_parameter_value pcie_a10_hip_0 pf4_virtio_notification_bar_indicator_hwtcl 0
set_instance_parameter_value pcie_a10_hip_0 pf4_virtio_notification_bar_offset_hwtcl 0
set_instance_parameter_value pcie_a10_hip_0 pf4_virtio_notification_structure_length_hwtcl 0
set_instance_parameter_value pcie_a10_hip_0 pf4_virtio_notify_off_multiplier_hwtcl 0
set_instance_parameter_value pcie_a10_hip_0 pf4_virtio_pciconfig_access_bar_indicator_hwtcl 0
set_instance_parameter_value pcie_a10_hip_0 pf4_virtio_pciconfig_access_bar_offset_hwtcl 0
set_instance_parameter_value pcie_a10_hip_0 pf4_virtio_pciconfig_access_structure_length_hwtcl 0
set_instance_parameter_value pcie_a10_hip_0 pf5_bar0_prefetchable_hwtcl 1
set_instance_parameter_value pcie_a10_hip_0 pf5_bar0_present_hwtcl 0
set_instance_parameter_value pcie_a10_hip_0 pf5_bar0_size_hwtcl 12
set_instance_parameter_value pcie_a10_hip_0 pf5_bar0_type_hwtcl 1
set_instance_parameter_value pcie_a10_hip_0 pf5_bar1_prefetchable_hwtcl 1
set_instance_parameter_value pcie_a10_hip_0 pf5_bar1_present_hwtcl 0
set_instance_parameter_value pcie_a10_hip_0 pf5_bar1_size_hwtcl 12
set_instance_parameter_value pcie_a10_hip_0 pf5_bar2_prefetchable_hwtcl 1
set_instance_parameter_value pcie_a10_hip_0 pf5_bar2_present_hwtcl 0
set_instance_parameter_value pcie_a10_hip_0 pf5_bar2_size_hwtcl 12
set_instance_parameter_value pcie_a10_hip_0 pf5_bar2_type_hwtcl 1
set_instance_parameter_value pcie_a10_hip_0 pf5_bar3_prefetchable_hwtcl 1
set_instance_parameter_value pcie_a10_hip_0 pf5_bar3_present_hwtcl 0
set_instance_parameter_value pcie_a10_hip_0 pf5_bar3_size_hwtcl 12
set_instance_parameter_value pcie_a10_hip_0 pf5_bar4_prefetchable_hwtcl 1
set_instance_parameter_value pcie_a10_hip_0 pf5_bar4_present_hwtcl 0
set_instance_parameter_value pcie_a10_hip_0 pf5_bar4_size_hwtcl 12
set_instance_parameter_value pcie_a10_hip_0 pf5_bar4_type_hwtcl 1
set_instance_parameter_value pcie_a10_hip_0 pf5_bar5_prefetchable_hwtcl 1
set_instance_parameter_value pcie_a10_hip_0 pf5_bar5_present_hwtcl 0
set_instance_parameter_value pcie_a10_hip_0 pf5_bar5_size_hwtcl 12
set_instance_parameter_value pcie_a10_hip_0 pf5_class_code_hwtcl 0
set_instance_parameter_value pcie_a10_hip_0 pf5_device_id_hwtcl 0
set_instance_parameter_value pcie_a10_hip_0 pf5_exprom_bar_present_hwtcl 0
set_instance_parameter_value pcie_a10_hip_0 pf5_exprom_bar_size_hwtcl 12
set_instance_parameter_value pcie_a10_hip_0 pf5_interrupt_pin_hwtcl inta
set_instance_parameter_value pcie_a10_hip_0 pf5_intr_line_hwtcl 0
set_instance_parameter_value pcie_a10_hip_0 pf5_msi_multi_message_capable_hwtcl 4
set_instance_parameter_value pcie_a10_hip_0 pf5_msix_pba_bir_hwtcl 0
set_instance_parameter_value pcie_a10_hip_0 pf5_msix_pba_offset_hwtcl 0
set_instance_parameter_value pcie_a10_hip_0 pf5_msix_table_bir_hwtcl 0
set_instance_parameter_value pcie_a10_hip_0 pf5_msix_table_offset_hwtcl 0
set_instance_parameter_value pcie_a10_hip_0 pf5_msix_table_size_hwtcl 0
set_instance_parameter_value pcie_a10_hip_0 pf5_pci_prog_intfc_byte_hwtcl 0
set_instance_parameter_value pcie_a10_hip_0 pf5_revision_id_hwtcl 0
set_instance_parameter_value pcie_a10_hip_0 pf5_subclass_code_hwtcl 0
set_instance_parameter_value pcie_a10_hip_0 pf5_subsystem_device_id_hwtcl 0
set_instance_parameter_value pcie_a10_hip_0 pf5_subsystem_vendor_id_hwtcl 0
set_instance_parameter_value pcie_a10_hip_0 pf5_vendor_id_hwtcl 0
set_instance_parameter_value pcie_a10_hip_0 pf5_vf_device_id_hwtcl 0
set_instance_parameter_value pcie_a10_hip_0 pf5_virtio_capability_present_hwtcl 0
set_instance_parameter_value pcie_a10_hip_0 pf5_virtio_cmn_config_bar_indicator_hwtcl 0
set_instance_parameter_value pcie_a10_hip_0 pf5_virtio_cmn_config_bar_offset_hwtcl 0
set_instance_parameter_value pcie_a10_hip_0 pf5_virtio_cmn_config_structure_length_hwtcl 0
set_instance_parameter_value pcie_a10_hip_0 pf5_virtio_device_specific_cap_present_hwtcl 0
set_instance_parameter_value pcie_a10_hip_0 pf5_virtio_devspecific_bar_indicator_hwtcl 0
set_instance_parameter_value pcie_a10_hip_0 pf5_virtio_devspecific_bar_offset_hwtcl 0
set_instance_parameter_value pcie_a10_hip_0 pf5_virtio_devspecific_structure_length_hwtcl 0
set_instance_parameter_value pcie_a10_hip_0 pf5_virtio_isrstatus_bar_indicator_hwtcl 0
set_instance_parameter_value pcie_a10_hip_0 pf5_virtio_isrstatus_bar_offset_hwtcl 0
set_instance_parameter_value pcie_a10_hip_0 pf5_virtio_isrstatus_structure_length_hwtcl 0
set_instance_parameter_value pcie_a10_hip_0 pf5_virtio_notification_bar_indicator_hwtcl 0
set_instance_parameter_value pcie_a10_hip_0 pf5_virtio_notification_bar_offset_hwtcl 0
set_instance_parameter_value pcie_a10_hip_0 pf5_virtio_notification_structure_length_hwtcl 0
set_instance_parameter_value pcie_a10_hip_0 pf5_virtio_notify_off_multiplier_hwtcl 0
set_instance_parameter_value pcie_a10_hip_0 pf5_virtio_pciconfig_access_bar_indicator_hwtcl 0
set_instance_parameter_value pcie_a10_hip_0 pf5_virtio_pciconfig_access_bar_offset_hwtcl 0
set_instance_parameter_value pcie_a10_hip_0 pf5_virtio_pciconfig_access_structure_length_hwtcl 0
set_instance_parameter_value pcie_a10_hip_0 pf6_bar0_prefetchable_hwtcl 1
set_instance_parameter_value pcie_a10_hip_0 pf6_bar0_present_hwtcl 0
set_instance_parameter_value pcie_a10_hip_0 pf6_bar0_size_hwtcl 12
set_instance_parameter_value pcie_a10_hip_0 pf6_bar0_type_hwtcl 1
set_instance_parameter_value pcie_a10_hip_0 pf6_bar1_prefetchable_hwtcl 1
set_instance_parameter_value pcie_a10_hip_0 pf6_bar1_present_hwtcl 0
set_instance_parameter_value pcie_a10_hip_0 pf6_bar1_size_hwtcl 12
set_instance_parameter_value pcie_a10_hip_0 pf6_bar2_prefetchable_hwtcl 1
set_instance_parameter_value pcie_a10_hip_0 pf6_bar2_present_hwtcl 0
set_instance_parameter_value pcie_a10_hip_0 pf6_bar2_size_hwtcl 12
set_instance_parameter_value pcie_a10_hip_0 pf6_bar2_type_hwtcl 1
set_instance_parameter_value pcie_a10_hip_0 pf6_bar3_prefetchable_hwtcl 1
set_instance_parameter_value pcie_a10_hip_0 pf6_bar3_present_hwtcl 0
set_instance_parameter_value pcie_a10_hip_0 pf6_bar3_size_hwtcl 12
set_instance_parameter_value pcie_a10_hip_0 pf6_bar4_prefetchable_hwtcl 1
set_instance_parameter_value pcie_a10_hip_0 pf6_bar4_present_hwtcl 0
set_instance_parameter_value pcie_a10_hip_0 pf6_bar4_size_hwtcl 12
set_instance_parameter_value pcie_a10_hip_0 pf6_bar4_type_hwtcl 1
set_instance_parameter_value pcie_a10_hip_0 pf6_bar5_prefetchable_hwtcl 1
set_instance_parameter_value pcie_a10_hip_0 pf6_bar5_present_hwtcl 0
set_instance_parameter_value pcie_a10_hip_0 pf6_bar5_size_hwtcl 12
set_instance_parameter_value pcie_a10_hip_0 pf6_class_code_hwtcl 0
set_instance_parameter_value pcie_a10_hip_0 pf6_device_id_hwtcl 0
set_instance_parameter_value pcie_a10_hip_0 pf6_exprom_bar_present_hwtcl 0
set_instance_parameter_value pcie_a10_hip_0 pf6_exprom_bar_size_hwtcl 12
set_instance_parameter_value pcie_a10_hip_0 pf6_interrupt_pin_hwtcl inta
set_instance_parameter_value pcie_a10_hip_0 pf6_intr_line_hwtcl 0
set_instance_parameter_value pcie_a10_hip_0 pf6_msi_multi_message_capable_hwtcl 4
set_instance_parameter_value pcie_a10_hip_0 pf6_msix_pba_bir_hwtcl 0
set_instance_parameter_value pcie_a10_hip_0 pf6_msix_pba_offset_hwtcl 0
set_instance_parameter_value pcie_a10_hip_0 pf6_msix_table_bir_hwtcl 0
set_instance_parameter_value pcie_a10_hip_0 pf6_msix_table_offset_hwtcl 0
set_instance_parameter_value pcie_a10_hip_0 pf6_msix_table_size_hwtcl 0
set_instance_parameter_value pcie_a10_hip_0 pf6_pci_prog_intfc_byte_hwtcl 0
set_instance_parameter_value pcie_a10_hip_0 pf6_revision_id_hwtcl 0
set_instance_parameter_value pcie_a10_hip_0 pf6_subclass_code_hwtcl 0
set_instance_parameter_value pcie_a10_hip_0 pf6_subsystem_device_id_hwtcl 0
set_instance_parameter_value pcie_a10_hip_0 pf6_subsystem_vendor_id_hwtcl 0
set_instance_parameter_value pcie_a10_hip_0 pf6_vendor_id_hwtcl 0
set_instance_parameter_value pcie_a10_hip_0 pf6_vf_device_id_hwtcl 0
set_instance_parameter_value pcie_a10_hip_0 pf6_virtio_capability_present_hwtcl 0
set_instance_parameter_value pcie_a10_hip_0 pf6_virtio_cmn_config_bar_indicator_hwtcl 0
set_instance_parameter_value pcie_a10_hip_0 pf6_virtio_cmn_config_bar_offset_hwtcl 0
set_instance_parameter_value pcie_a10_hip_0 pf6_virtio_cmn_config_structure_length_hwtcl 0
set_instance_parameter_value pcie_a10_hip_0 pf6_virtio_device_specific_cap_present_hwtcl 0
set_instance_parameter_value pcie_a10_hip_0 pf6_virtio_devspecific_bar_indicator_hwtcl 0
set_instance_parameter_value pcie_a10_hip_0 pf6_virtio_devspecific_bar_offset_hwtcl 0
set_instance_parameter_value pcie_a10_hip_0 pf6_virtio_devspecific_structure_length_hwtcl 0
set_instance_parameter_value pcie_a10_hip_0 pf6_virtio_isrstatus_bar_indicator_hwtcl 0
set_instance_parameter_value pcie_a10_hip_0 pf6_virtio_isrstatus_bar_offset_hwtcl 0
set_instance_parameter_value pcie_a10_hip_0 pf6_virtio_isrstatus_structure_length_hwtcl 0
set_instance_parameter_value pcie_a10_hip_0 pf6_virtio_notification_bar_indicator_hwtcl 0
set_instance_parameter_value pcie_a10_hip_0 pf6_virtio_notification_bar_offset_hwtcl 0
set_instance_parameter_value pcie_a10_hip_0 pf6_virtio_notification_structure_length_hwtcl 0
set_instance_parameter_value pcie_a10_hip_0 pf6_virtio_notify_off_multiplier_hwtcl 0
set_instance_parameter_value pcie_a10_hip_0 pf6_virtio_pciconfig_access_bar_indicator_hwtcl 0
set_instance_parameter_value pcie_a10_hip_0 pf6_virtio_pciconfig_access_bar_offset_hwtcl 0
set_instance_parameter_value pcie_a10_hip_0 pf6_virtio_pciconfig_access_structure_length_hwtcl 0
set_instance_parameter_value pcie_a10_hip_0 pf7_bar0_prefetchable_hwtcl 1
set_instance_parameter_value pcie_a10_hip_0 pf7_bar0_present_hwtcl 0
set_instance_parameter_value pcie_a10_hip_0 pf7_bar0_size_hwtcl 12
set_instance_parameter_value pcie_a10_hip_0 pf7_bar0_type_hwtcl 1
set_instance_parameter_value pcie_a10_hip_0 pf7_bar1_prefetchable_hwtcl 1
set_instance_parameter_value pcie_a10_hip_0 pf7_bar1_present_hwtcl 0
set_instance_parameter_value pcie_a10_hip_0 pf7_bar1_size_hwtcl 12
set_instance_parameter_value pcie_a10_hip_0 pf7_bar2_prefetchable_hwtcl 1
set_instance_parameter_value pcie_a10_hip_0 pf7_bar2_present_hwtcl 0
set_instance_parameter_value pcie_a10_hip_0 pf7_bar2_size_hwtcl 12
set_instance_parameter_value pcie_a10_hip_0 pf7_bar2_type_hwtcl 1
set_instance_parameter_value pcie_a10_hip_0 pf7_bar3_prefetchable_hwtcl 1
set_instance_parameter_value pcie_a10_hip_0 pf7_bar3_present_hwtcl 0
set_instance_parameter_value pcie_a10_hip_0 pf7_bar3_size_hwtcl 12
set_instance_parameter_value pcie_a10_hip_0 pf7_bar4_prefetchable_hwtcl 1
set_instance_parameter_value pcie_a10_hip_0 pf7_bar4_present_hwtcl 0
set_instance_parameter_value pcie_a10_hip_0 pf7_bar4_size_hwtcl 12
set_instance_parameter_value pcie_a10_hip_0 pf7_bar4_type_hwtcl 1
set_instance_parameter_value pcie_a10_hip_0 pf7_bar5_prefetchable_hwtcl 1
set_instance_parameter_value pcie_a10_hip_0 pf7_bar5_present_hwtcl 0
set_instance_parameter_value pcie_a10_hip_0 pf7_bar5_size_hwtcl 12
set_instance_parameter_value pcie_a10_hip_0 pf7_class_code_hwtcl 0
set_instance_parameter_value pcie_a10_hip_0 pf7_device_id_hwtcl 0
set_instance_parameter_value pcie_a10_hip_0 pf7_exprom_bar_present_hwtcl 0
set_instance_parameter_value pcie_a10_hip_0 pf7_exprom_bar_size_hwtcl 12
set_instance_parameter_value pcie_a10_hip_0 pf7_interrupt_pin_hwtcl inta
set_instance_parameter_value pcie_a10_hip_0 pf7_intr_line_hwtcl 0
set_instance_parameter_value pcie_a10_hip_0 pf7_msi_multi_message_capable_hwtcl 4
set_instance_parameter_value pcie_a10_hip_0 pf7_msix_pba_bir_hwtcl 0
set_instance_parameter_value pcie_a10_hip_0 pf7_msix_pba_offset_hwtcl 0
set_instance_parameter_value pcie_a10_hip_0 pf7_msix_table_bir_hwtcl 0
set_instance_parameter_value pcie_a10_hip_0 pf7_msix_table_offset_hwtcl 0
set_instance_parameter_value pcie_a10_hip_0 pf7_msix_table_size_hwtcl 0
set_instance_parameter_value pcie_a10_hip_0 pf7_pci_prog_intfc_byte_hwtcl 0
set_instance_parameter_value pcie_a10_hip_0 pf7_revision_id_hwtcl 0
set_instance_parameter_value pcie_a10_hip_0 pf7_subclass_code_hwtcl 0
set_instance_parameter_value pcie_a10_hip_0 pf7_subsystem_device_id_hwtcl 0
set_instance_parameter_value pcie_a10_hip_0 pf7_subsystem_vendor_id_hwtcl 0
